# EAGLE design Photon-IMU-Shield (EAGLE 7.1.0)
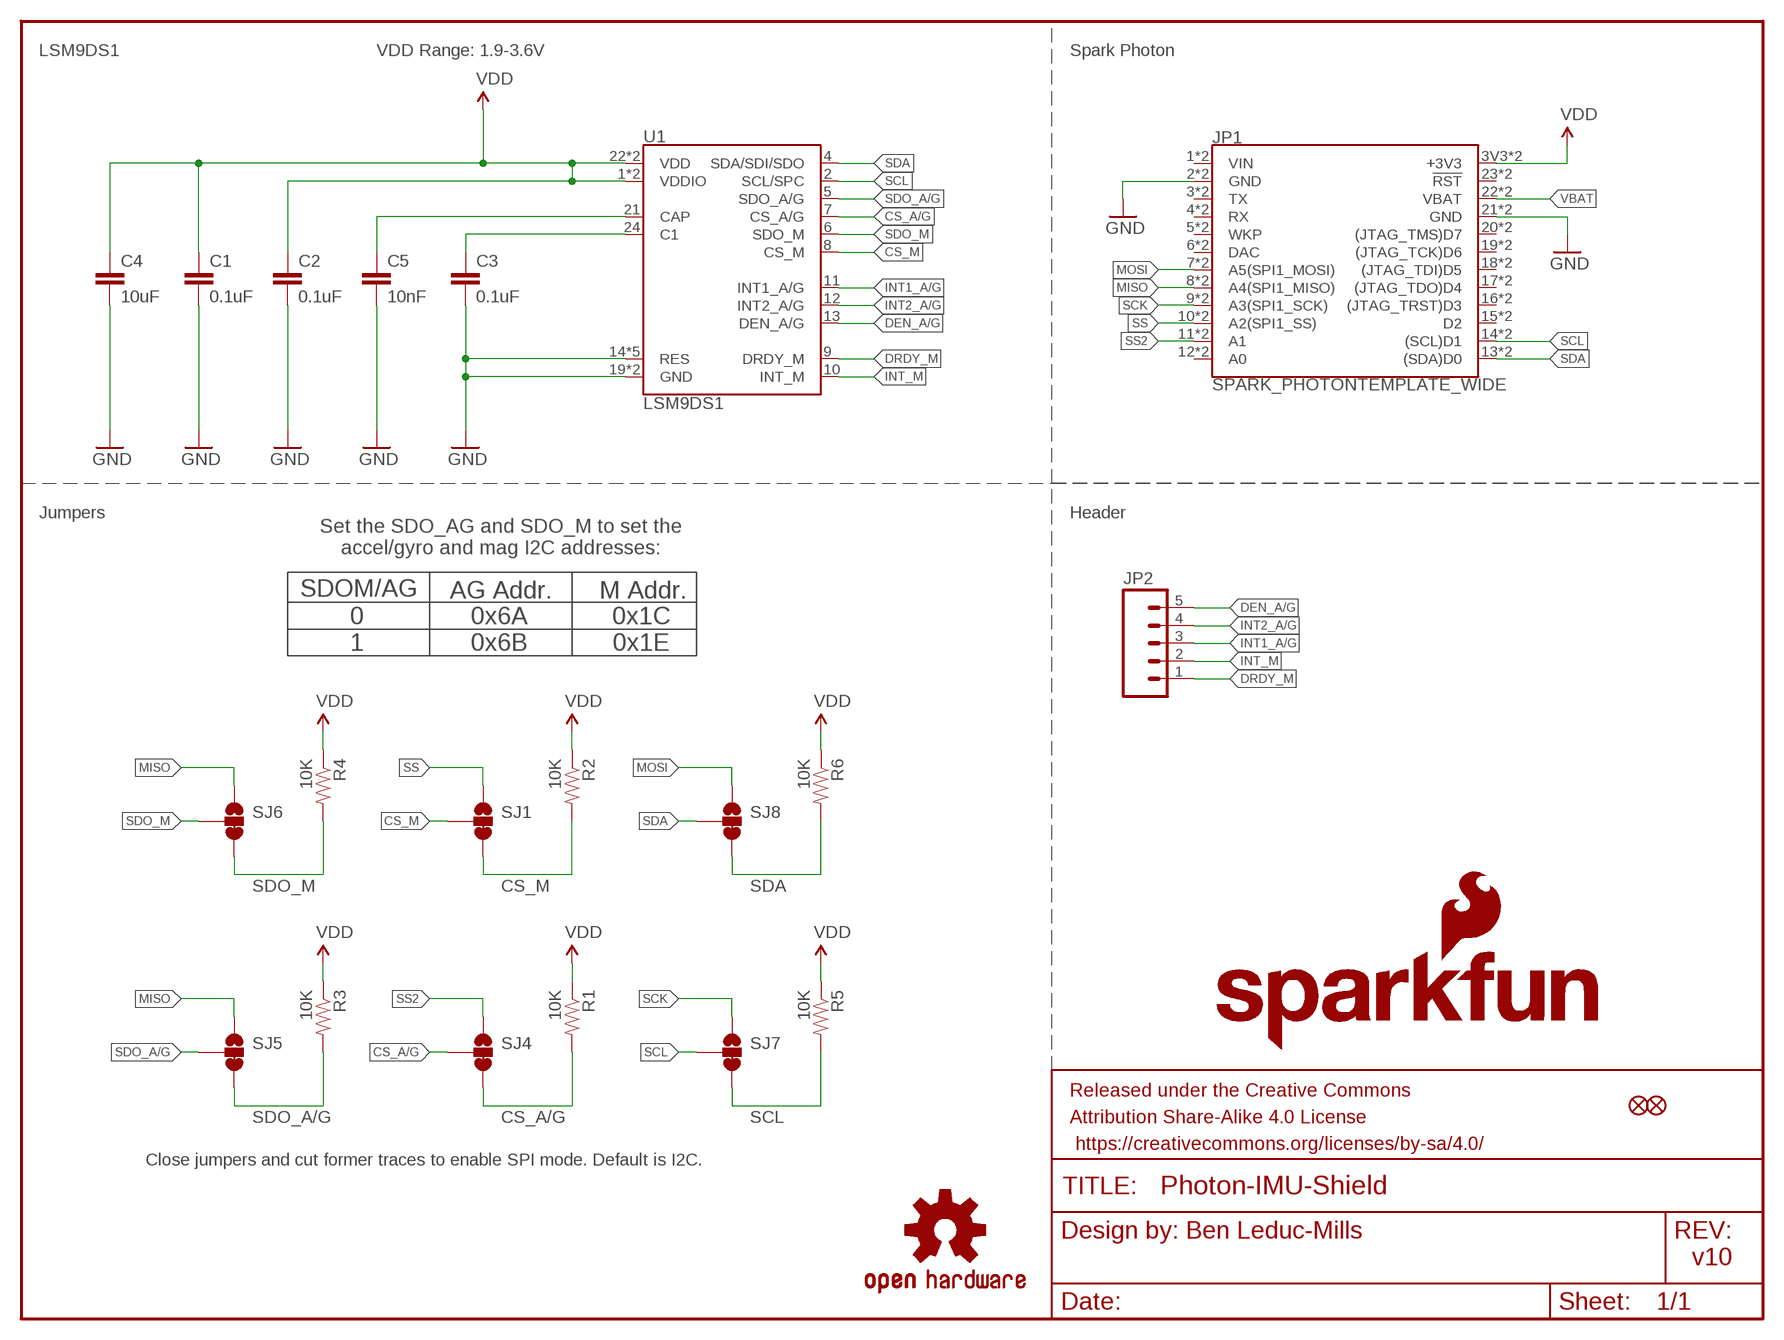
[diagram p0: schematic, sheet 1]

## Parts
C1  0.1uF  0.1UF-25V(+80/-20%)(0603)  [0603-CAP]
C2  0.1uF  0.1UF-25V(+80/-20%)(0603)  [0603-CAP]
C3  0.1uF  0.1UF-25V(+80/-20%)(0603)  [0603-CAP]
C4  10uF  10UF-6.3V-20%(0603)  [0603-CAP]
C5  10nF  10NF/10000PF-50V-10%(0603)  [0603-CAP]
FID1  FIDUCIAL1X2  [FIDUCIAL-1X2]
FID2  FIDUCIAL1X2  [FIDUCIAL-1X2]
FRAME1  FRAME-LETTER  [CREATIVE_COMMONS]
JP1  SPARK_PHOTONTEMPLATE_WIDE  [SPARK_PHOTON_TEMPLATE_WIDE]
JP2  M05PTH  [1X05]
LOGO1  SFE_LOGO_NAME_FLAME.1_INCH  [SFE_LOGO_NAME_FLAME_.1]
LOGO2  OSHW-LOGOS  [OSHW-LOGO-S]
R1  10K  10KOHM1/10W1%(0603)0603  [0603-RES]
R2  10K  10KOHM1/10W1%(0603)0603  [0603-RES]
R3  10K  10KOHM1/10W1%(0603)0603  [0603-RES]
R4  10K  10KOHM1/10W1%(0603)0603  [0603-RES]
R5  10K  10KOHM1/10W1%(0603)0603  [0603-RES]
R6  10K  10KOHM1/10W1%(0603)0603  [0603-RES]
SJ1  JUMPER-PAD-3-2OF3_NC_BY_TRACE_SMALL  [PAD-JUMPER-3-2OF3_NC_BY_TRACE_YES_SILK_FULL_BOX]
SJ4  JUMPER-PAD-3-2OF3_NC_BY_TRACE_SMALL  [PAD-JUMPER-3-2OF3_NC_BY_TRACE_YES_SILK_FULL_BOX]
SJ5  JUMPER-PAD-3-2OF3_NC_BY_TRACE_SMALL  [PAD-JUMPER-3-2OF3_NC_BY_TRACE_YES_SILK_FULL_BOX]
SJ6  JUMPER-PAD-3-2OF3_NC_BY_TRACE_SMALL  [PAD-JUMPER-3-2OF3_NC_BY_TRACE_YES_SILK_FULL_BOX]
SJ7  JUMPER-PAD-3-2OF3_NC_BY_TRACE_SMALL  [PAD-JUMPER-3-2OF3_NC_BY_TRACE_YES_SILK_FULL_BOX]
SJ8  JUMPER-PAD-3-2OF3_NC_BY_TRACE_SMALL  [PAD-JUMPER-3-2OF3_NC_BY_TRACE_YES_SILK_FULL_BOX]
U1  LSM9DS1  [LGA24-8X4]

## Nets
CS_A/G: R1.2 SJ4.2 SJ4.3 U1.7(CS_A/G)
CS_M: R2.2 SJ1.2 SJ1.3 U1.8(CS_M)
DEN_A/G: JP2.5 U1.13(DEN_A/G)
DRDY_M: JP2.1 U1.9(DRDY_M)
GND: C1.2 C2.2 C3.2 C4.2 C5.2 JP1.2(GND) JP1.21(GND) JP1.GND@0(GND) JP1.GND@2(GND) U1.14(RES) U1.15(RES) U1.16(RES) U1.17(RES) U1.18(RES) U1.19(GND) U1.20(GND)
INT1_A/G: JP2.3 U1.11(INT1_A/G)
INT2_A/G: JP2.4 U1.12(INT2_A/G)
INT_M: JP2.2 U1.10(INT_M)
MISO: JP1.8(A4(SPI1_MISO)) JP1.A4(A4(SPI1_MISO)) SJ5.1 SJ6.1
MOSI: JP1.7(A5(SPI1_MOSI)) JP1.A5(A5(SPI1_MOSI)) SJ8.1
N$3: C5.1 U1.21(CAP)
N$4: C3.1 U1.24(C1)
SCK: JP1.9(A3(SPI1_SCK)) JP1.A3(A3(SPI1_SCK)) SJ7.1
SCL: JP1.14((SCL)D1) JP1.D1((SCL)D1) R5.2 SJ7.2 SJ7.3 U1.2(SCL/SPC)
SDA: JP1.13((SDA)D0) JP1.D0((SDA)D0) R6.2 SJ8.2 SJ8.3 U1.4(SDA/SDI/SDO)
SDO_A/G: R3.2 SJ5.2 SJ5.3 U1.5(SDO_A/G)
SDO_M: R4.2 SJ6.2 SJ6.3 U1.6(SDO_M)
SS: JP1.10(A2(SPI1_SS)) JP1.A2(A2(SPI1_SS)) SJ1.1
SS2: JP1.11(A1) JP1.A1 SJ4.1
VBAT: JP1.22(VBAT) JP1.VBAT
VDD: C1.1 C2.1 C4.1 JP1.3V3(+3V3) JP1.24(+3V3) R1.1 R2.1 R3.1 R4.1 R5.1 R6.1 U1.1(VDDIO) U1.3(VDDIO) U1.22(VDD) U1.23(VDD)
Unconnected: JP1.1(VIN) JP1.3(TX) JP1.4(RX) JP1.5(WKP) JP1.6(DAC) JP1.12(A0) JP1.15(D2) JP1.16((JTAG_TRST)D3) JP1.17((JTAG_TDO)D4) JP1.18((JTAG_TDI)D5) JP1.19((JTAG_TCK)D6) JP1.20((JTAG_TMS)D7) JP1.23(!RST!) JP1.A0 JP1.D2 JP1.D3((JTAG_TRST)D3) JP1.D4((JTAG_TDO)D4) JP1.D5((JTAG_TDI)D5) JP1.D6((JTAG_TCK)D6) JP1.D7((JTAG_TMS)D7) JP1.DAC JP1.RST(!RST!) JP1.RX JP1.TX JP1.VIN JP1.WKP

## Notes on the sheet
- LSM9DS1 | VDD Range: 1.9-3.6V | Spark Photon
- Jumpers | Header
- Set the SDO_AG and SDO_M to set the
  accel/gyro and mag I2C addresses:
- SDOM/AG | AG Addr. | M Addr.
- 0
  1
- 0x6A
  0x6B
- 0x1C
  0x1E
- Close jumpers and cut former traces to enable SPI mode. Default is I2C.
- v10

## Library data of the parts
C1-C3 = SparkFun-Capacitors:0.1UF-25V(+80/-20%)(0603): CAP-00810 Ceramic Standard decoupling cap; PROD_ID: CAP-00810
C4 = SparkFun-Capacitors:10UF-6.3V-20%(0603): CAP-11015; PROD_ID: CAP-11015
C5 = SparkFun-Capacitors:10NF/10000PF-50V-10%(0603): CAP-00867; PROD_ID: CAP-00867
FID1 FID2 = SparkFun-Aesthetics:FIDUCIAL: Fiducial Alignment Points Various fiducial points for machine vision alignment.
FRAME1 = SparkFun-Aesthetics:FRAME-LETTER: Schematic Frame Standard 8.5x11 US Letter frame
JP1 = template_temp:SPARK_PHOTON
JP2 = SparkFun-Connectors:M05: Header 5 Standard 5-pin 0.1" header. Use with straight break away headers (SKU : PRT-00116), right angle break away headers (PRT-00553), swiss pins (PRT-00743), machine pins (PRT-00117), and female headers (PRT-00115). Molex polarized connector foot print use with SKU : PRT-08230 with associated crimp pins and housings.
LOGO1 = SparkFun-Aesthetics:SFE_LOGO_NAME_FLAME: SFE Logo, name and flame This is the SparkFun full logo. The logo on the schematic will always be the same size; the package variant is the height of the flame part of the logo. Default layer for the logo on the board is tSilk.
LOGO2 = SparkFun-Aesthetics:OSHW-LOGO: Open Source Hardware Logo This logo indicates the piece of hardware it is found on incorporates a OSHW license and/or adheres to the definition of open source hardware found here: http://freedomdefined.org/OSHW
R1-R6 = SparkFun-Resistors:10KOHM1/10W1%(0603): RES-00824; PROD_ID: RES-00824
SJ1 SJ4-SJ8 = SparkFun-Passives:JUMPER-PAD-3-2OF3_NC_BY_TRACE
U1 = LSM9DS1_temp:LSM9DS1: LSM9DS1 3D accelerometer, gyroscope & magnetometer The LSM9DS1 is a system-in-package featuring a 3D digital linear acceleration sensor, a 3D digital angular rate sensor, and a 3D digital magnetic sensor. The LSM9DS1 has a linear acceleration full scale of ±2g/±4g/±8/±16 g, a magnetic field full scale of ±4/±8/±12/±16 gauss and an angular rate of ±245/±500/±2000 dps. The LSM9DS1 includes an I2 C serial bus interface supporting standard and fast mode (100 kHz and 400 kHz) and an SPI serial standard interface. Magnetic, accelerometer and gyroscope sensing can be enabled or set in power-down mode separately for smart power management. The LSM9DS1 is available in a plastic land grid array package (LGA) and it is guaranteed to operate over an extended temperature range from -40 °C to +85 °C.; PROD_ID: IC-12536

## Board
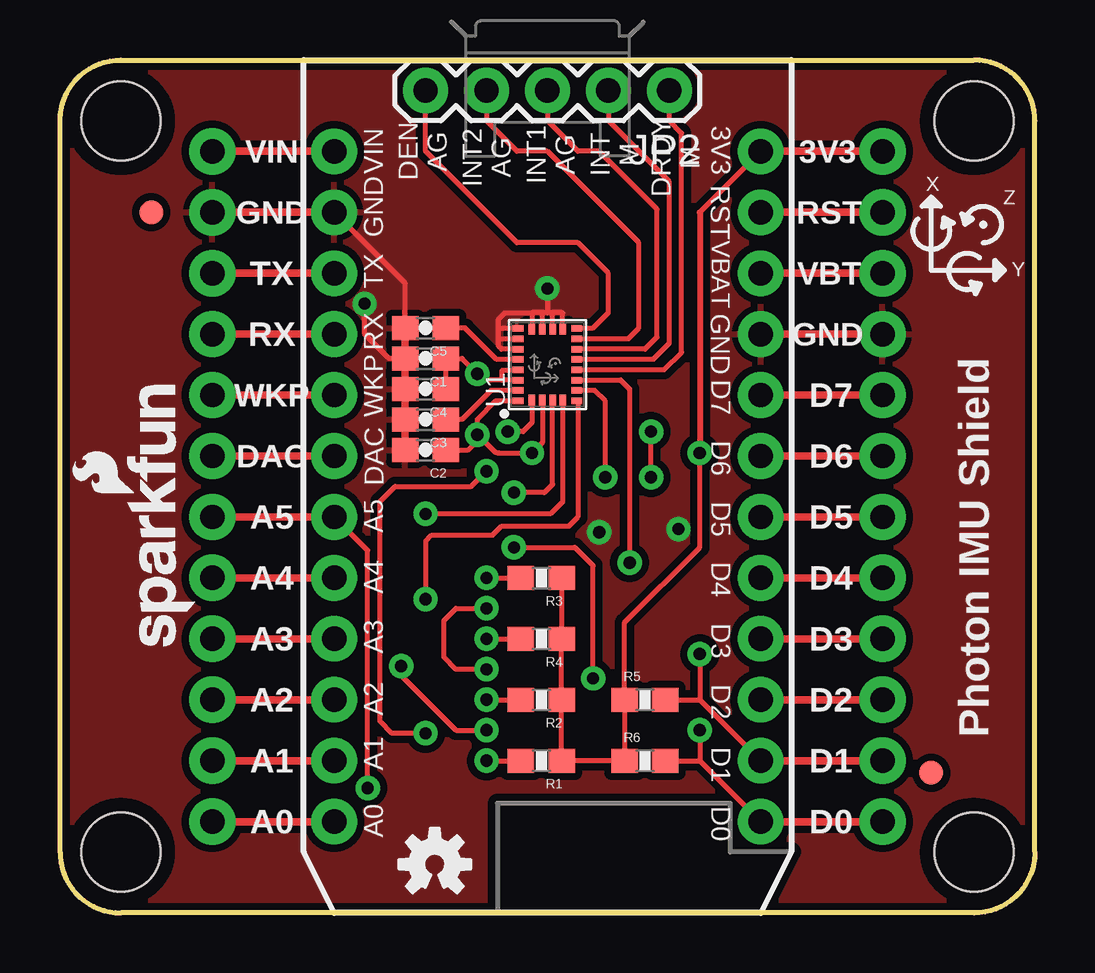
[diagram p1: board, top side]
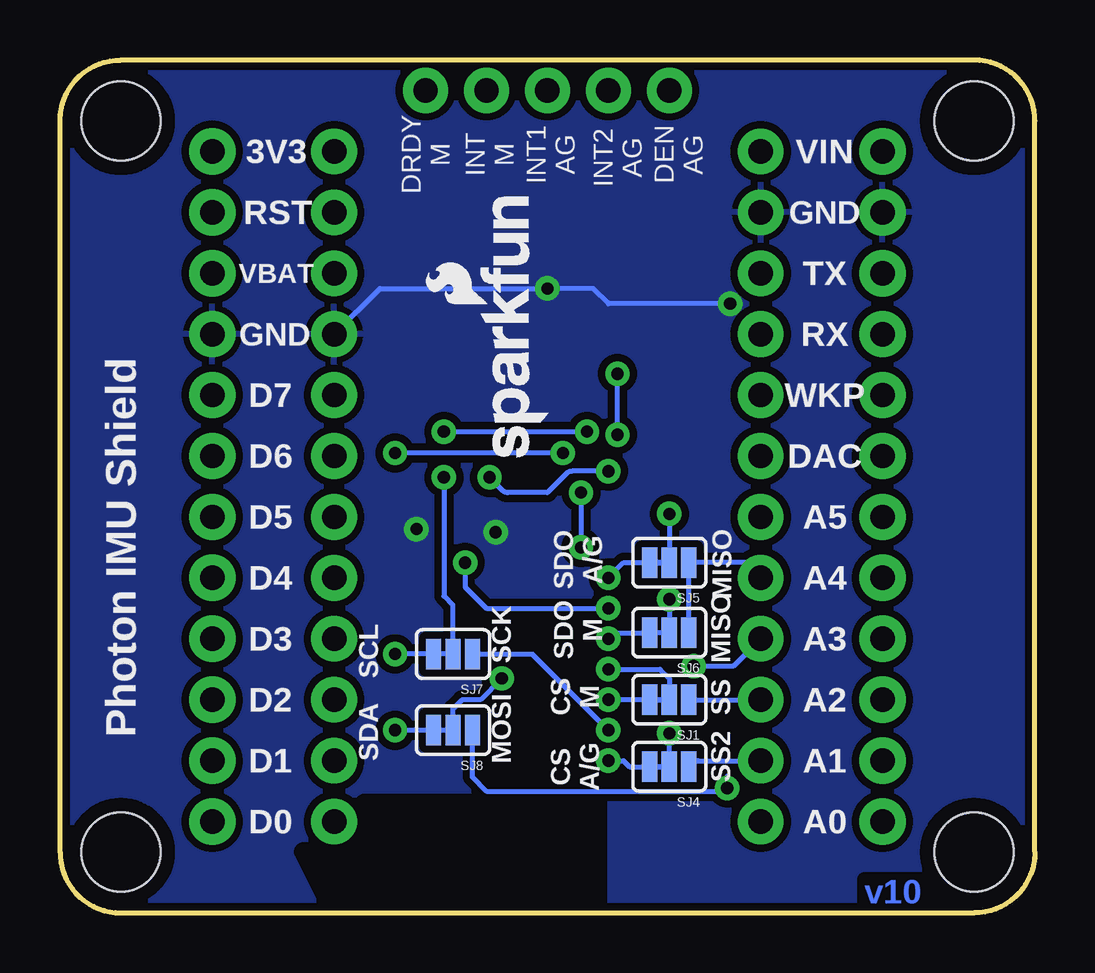
[diagram p2: board, bottom side, seen from below]

Size 40.64 x 35.56 mm. Coordinates in mm from the lower left corner, seen from the top.
Outline: 2.54,35.56 38.1,35.56 arc-90 40.64,33.02 40.64,2.54 arc-90 38.1,0 2.54,0 arc-90 0,2.54 0,33.02 arc-90 2.54,35.56
Copper layers (1*16): Top 0.035mm / dielectric 1.5mm / Bottom 0.035mm
Design rules "SparkFun-2-layer": minimum track width 7mil, minimum drill 15mil, track to track 8mil, track to pad 8mil, pad to pad 8mil, via to via 8mil, smd to smd 8mil, copper to edge 8mil, drill to drill 8mil, minimum pad ring 12mil, minimum via ring 10mil, stop-mask expansion 4mil, vias tented up to drill 20mil, thermal gap 10mil

### Footprints (pad centres in the part's own frame; a part is rotated, then mirrored left to right if it is on the bottom)
0603-CAP = smd 1.1 x 1: 1 -0.85,0; 2 0.85,0
FIDUCIAL-1X2 = smd 1 x 1: 1 0,0
SPARK_PHOTON_TEMPLATE_WIDE = drill 1.016 pad 1.905: 1 1.27,31.75; 2 1.27,29.21; 3 1.27,26.67; 4 1.27,24.13; 5 1.27,21.59; 6 1.27,19.05; 7 1.27,16.51; 8 1.27,13.97; 9 1.27,11.43; 10 1.27,8.89; 11 1.27,6.35; 12 1.27,3.81; 13 19.05,3.81; 14 19.05,6.35; 15 19.05,8.89; 16 19.05,11.43; 17 19.05,13.97; 18 19.05,16.51; 19 19.05,19.05; 20 19.05,21.59; 21 19.05,24.13; 22 19.05,26.67; 23 19.05,29.21; 24 19.05,31.75 | drill 1.016 pad 1.93: 3V3 24.13,31.75; A0 -3.81,3.81; A1 -3.81,6.35; A2 -3.81,8.89; A3 -3.81,11.43; A4 -3.81,13.97; A5 -3.81,16.51; D0 24.13,3.81; D1 24.13,6.35; D2 24.13,8.89; D3 24.13,11.43; D4 24.13,13.97; D5 24.13,16.51; D6 24.13,19.05; D7 24.13,21.59; DAC -3.81,19.05; GND@0 -3.81,29.21; GND@2 24.13,24.13; RST 24.13,29.21; RX -3.81,24.13; TX -3.81,26.67; VBAT 24.13,26.67; VIN -3.81,31.75; WKP -3.81,21.59 | hole 3.302: -7.62,33.02; 27.94,33.02; -7.62,2.54; 27.94,2.54
1X05 = drill 1.016 pad 1.88: 1 0,0; 2 2.54,0; 3 5.08,0; 4 7.62,0; 5 10.16,0
0603-RES = smd 1.1 x 1: 1 -0.85,0; 2 0.85,0
PAD-JUMPER-3-2OF3_NC_BY_TRACE_YES_SILK_FULL_BOX = smd 0.635 x 1.27: 1 -0.813,0; 2 0,0; 3 0.813,0
LGA24-8X4 = smd 0.27 x 0.45: 1 -1.505,1.225; 6 -1.505,-1.225; 7 -1.075,-1.225; 8 -0.645,-1.225; 9 -0.215,-1.225; 10 0.215,-1.225; 11 0.645,-1.225; 12 1.075,-1.225; 13 1.505,-1.225; 18 1.505,1.225; 19 1.075,1.225; 20 0.645,1.225; 21 0.215,1.225; 22 -0.215,1.225; 23 -0.645,1.225; 24 -1.075,1.225 | smd 0.45 x 0.27: 2 -1.475,0.645; 3 -1.475,0.215; 4 -1.475,-0.215; 5 -1.475,-0.645; 14 1.475,-0.645; 15 1.475,-0.215; 16 1.475,0.215; 17 1.475,0.645

### Placement (x,y rotation side)
C1  15.24,23.11 180 top
C2  15.24,19.3 180 top
C3  15.24,20.57 180 top
C4  15.24,21.84 180 top
C5  15.24,24.38 180 top
FID1  3.81,29.21 0 top
FID2  36.32,5.84 0 top
FRAME1  -16.51,-10.16 0 top  (outside the outline)
JP1  10.16,0 0 top
JP2  25.4,34.29 180 top
LOGO1  5.71,10.67 90 top
LOGO2  15.62,2.03 0 top
R1  20.07,6.35 180 top
R2  20.07,8.89 180 top
R3  20.07,13.97 180 top
R4  20.07,11.43 180 top
R5  24.38,8.89 0 top
R6  24.38,6.35 0 top
SJ1  15.24,8.89 180 bottom
SJ4  15.24,6.1 180 bottom
SJ5  15.24,14.61 180 bottom
SJ6  15.24,11.68 180 bottom
SJ7  24.26,10.79 180 bottom
SJ8  24.26,7.62 180 bottom
U1  20.32,22.86 90 top
U$5  [SFE_LOGO_NAME_FLAME_.1]  20.19,18.54 90 bottom

### Tracks (layer width: path | path; a pad name or v marks a point on that pad's centre or on a via)
CS_A/G  (via drill 0.51)
  Top 0.203: v17.78,6.35 R1.2 | v22.73,18.16 22.73,21.34 22.28,21.79 U1.7 | v15.24,7.49 13.84,7.49 13.34,8 13.34,17.14 13.97,17.78 17.14,17.78 v17.78,18.41
  Bottom 0.203: v15.24,7.49 SJ4.2 15.88,6.1 SJ4.3 16.89,6.1 17.14,6.35 v17.78,6.35 | v17.78,18.41 19.3,18.41 arc-45 19.52,18.32 20.32,17.53 21.97,17.53 arc45 22.19,17.62 v22.73,18.16
CS_M  (via drill 0.51)
  Top 0.203: v17.78,8.89 R2.2 | U1.8 21.55,22.23 23.37,22.23 23.75,21.84 v23.75,14.61 | v17.78,10.16 16.51,10.16 16,10.67 16,12.19 16.51,12.7 v17.78,12.7
  Bottom 0.203: v17.78,8.89 SJ1.3 15.88,8.89 SJ1.2 15.24,9.78 15.62,10.16 v17.78,10.16 | v23.75,14.61 23.75,13.59 22.86,12.7 v17.78,12.7
DEN_A/G
  Top 0.203: U1.13 21.56,24.38 22.22,24.38 22.86,25.02 22.86,26.67 21.59,27.94 19.05,27.94 15.24,31.75 JP2.5
DRDY_M
  Top 0.203: U1.9 25.18,22.64 25.91,23.37 25.91,32.51 25.4,33.02 JP2.1
GND  (via drill 0.51)
  Top 0.203: U1.14 20.95,24.34 20.95,25.02 20.54,25.02 | 20.11,25.02 19.68,25.02 | 19.68,25.02 19.68,25.01 U1.17 | U1.16 20.11,25.02 | U1.15 20.54,25.02 | 20.54,25.02 20.32,25.02 | 20.32,25.02 20.11,25.02 | U1.20 18.41,23.5 18.29,23.62 18.29,23.88 | C4.2 C1.2 | C1.2 14.39,26.25 JP1.2 | v20.32,26.04 20.32,25.02 | v12.7,25.4 12.7,24.13 13.72,23.11 C1.2 | 18.29,23.88 18.29,24.38 | 18.29,24.38 18.29,24.77 18.54,25.02 19.68,25.02 | U1.19 18.35,23.93 18.29,23.88 | U1.18 18.31,24.36 18.29,24.38
  Top 0.305: C2.2 C3.2 C1.2 C5.2
  Bottom 0.203: v12.7,25.4 17.78,25.4 18.41,26.04 v20.32,26.04 27.3,26.04 JP1.21
  other vias: 25.78,16 22.48,15.88
  pour Top (isolate 0.305): 0,0 40.64,0 40.64,35.56 0,35.56
  pour Bottom (isolate 0.305): 0,0 40.64,0 40.64,35.56 0,35.56
INT1_A/G
  Top 0.203: U1.11 24.39,23.5 24.89,24 24.89,29.34 22.48,31.75 21.59,31.75 20.32,33.02 JP2.3
INT2_A/G
  Top 0.203: U1.12 23.68,23.93 24.13,24.38 24.13,27.94 20.32,31.75 19.05,31.75 17.78,33.02 JP2.4
INT_M
  Top 0.203: U1.10 24.73,23.07 25.4,23.75 25.4,30.48 22.86,33.02 JP2.2
MISO
  Bottom 0.203: SJ6.1 SJ5.1 12.07,14.61 JP1.8
MOSI  (via drill 0.51)
  Top 0.203: v12.83,5.21 12.83,15.11 JP1.7
  Bottom 0.203: 12.83,5.71 v12.83,5.21 12.95,5.08 22.86,5.08 23.44,5.66 SJ8.1
N$3
  Top 0.203: U1.21 18.2,23.07 16.89,24.38 C5.1
N$4
  Top 0.203: U1.24 17.98,21.79 16.76,20.57 C3.1
SCK  (via drill 0.51)
  Top 0.203: v17.78,7.62 16.51,7.62 14.22,9.91 v14.22,10.29
  Bottom 0.203: SJ7.1 20.95,10.79 v17.78,7.62 | JP1.9 12.57,10.29 v14.22,10.29
SCL  (via drill 0.51)
  Top 0.203: R5.2 26.67,8.89 | 26.67,8.89 JP1.14 | v26.67,10.79 26.67,8.89 | U1.2 19.68,20.44 19.3,20.07 v18.67,20.07 | v24.64,18.16 v24.64,20.07
  Bottom 0.203: SJ7.3 v26.67,10.79 | SJ7.2 24.26,12.83 24.64,13.21 v24.64,18.16 | v24.64,20.07 v18.67,20.07
  Bottom 0.305: SJ7.3 24.89,10.79
SDA  (via drill 0.51)
  Top 0.203: R6.2 26.67,6.35 | 26.67,6.35 JP1.13 | v26.67,7.62 26.67,6.35 | 20.57,21.35 U1.4 20.54,17.87 20.19,17.53 v18.92,17.53 | v22.22,9.78 22.22,14.48 21.46,15.24 v18.92,15.24
  Bottom 0.203: v26.67,7.62 SJ8.3 24.89,7.62 | SJ8.2 24.26,8.51 23.88,8.89 23.11,8.89 v22.22,9.78 | v18.92,17.53 v18.92,15.24
SDO_A/G  (via drill 0.51)
  Top 0.203: v17.78,13.97 R3.2 | v15.24,16.64 20.45,16.64 20.96,17.16 U1.5 20.95,21.38
  Bottom 0.203: v15.24,16.64 SJ5.2 | v17.78,13.97 17.14,14.61 SJ5.3
  Bottom 0.254: SJ5.2 15.88,14.61 SJ5.3
SDO_M  (via drill 0.51)
  Top 0.203: v17.78,11.43 R4.2 | U1.6 21.59,21.31 21.59,16.51 21.21,16.13 18.41,16.13 18.03,15.75 15.49,15.75 15.24,15.49 v15.24,13.08
  Bottom 0.203: v15.24,13.08 SJ6.2 | v17.78,11.43 17.53,11.68 SJ6.3 15.88,11.68
SS
  Bottom 0.203: SJ1.1 JP1.10
SS2
  Bottom 0.203: SJ4.1 14.27,6.26 arc45 14.04,6.35 JP1.11
VDD  (via drill 0.51)
  Top 0.203: R3.1 R4.1 R2.1 R1.1 R6.1 R5.1 23.53,12.1 26.67,15.24 v26.67,19.18 | 19.13,22.61 U1.22 19.06,22.61 18.41,22.61 18.41,22.21 | C4.1 C1.1 16.76,23.11 v17.4,22.48 17.66,22.21 18.41,22.21 | U1.23 18.41,22.21 | 19.05,21.31 U1.1 18.21,21.36 arc45 18.16,21.34 17.4,20.57 v17.4,19.94 | C2.1 17.02,19.3 17.4,19.68 v17.4,19.94 | U1.3 20.11,19.61 v19.68,19.18 18.29,19.18 arc-45 18.07,19.27 v17.4,19.94 | JP1.24 26.67,29.21
  Top 0.254: 26.67,29.21 v26.67,19.18
  Bottom 0.203: v17.4,19.94 v17.4,22.48 | v19.68,19.18 v26.67,19.18

### Text on the board
Bottom: v10
tPlace: 3V3 | DEN / AG | INT1 / AG | INT / M | VIN | INT2 / AG | DRDY / M | RST | X | Z | GND | VBAT | Y | TX | GND | RX | D7 | WKP | D6 | DAC | D5 | A5 | D4 | Photon IMU Shield | A4 | D3 | A3 | D2 | A2 | D1 | A1 | D0 | A0
bPlace: DEN / AG | INT1 / AG | INT / M | DRDY / M | INT2 / AG | MISO | SDO / A/G | Photon IMU Shield | SDO / M | SCL | MISO | SCK | CS / M | SDA | SS | CS / A/G | MOSI | SS2
Measures: Units in Inches
tDocu: Ben Leduc-Mills